# EAGLE design Arduino_S3v3_R2_ftdi (EAGLE 6.2)
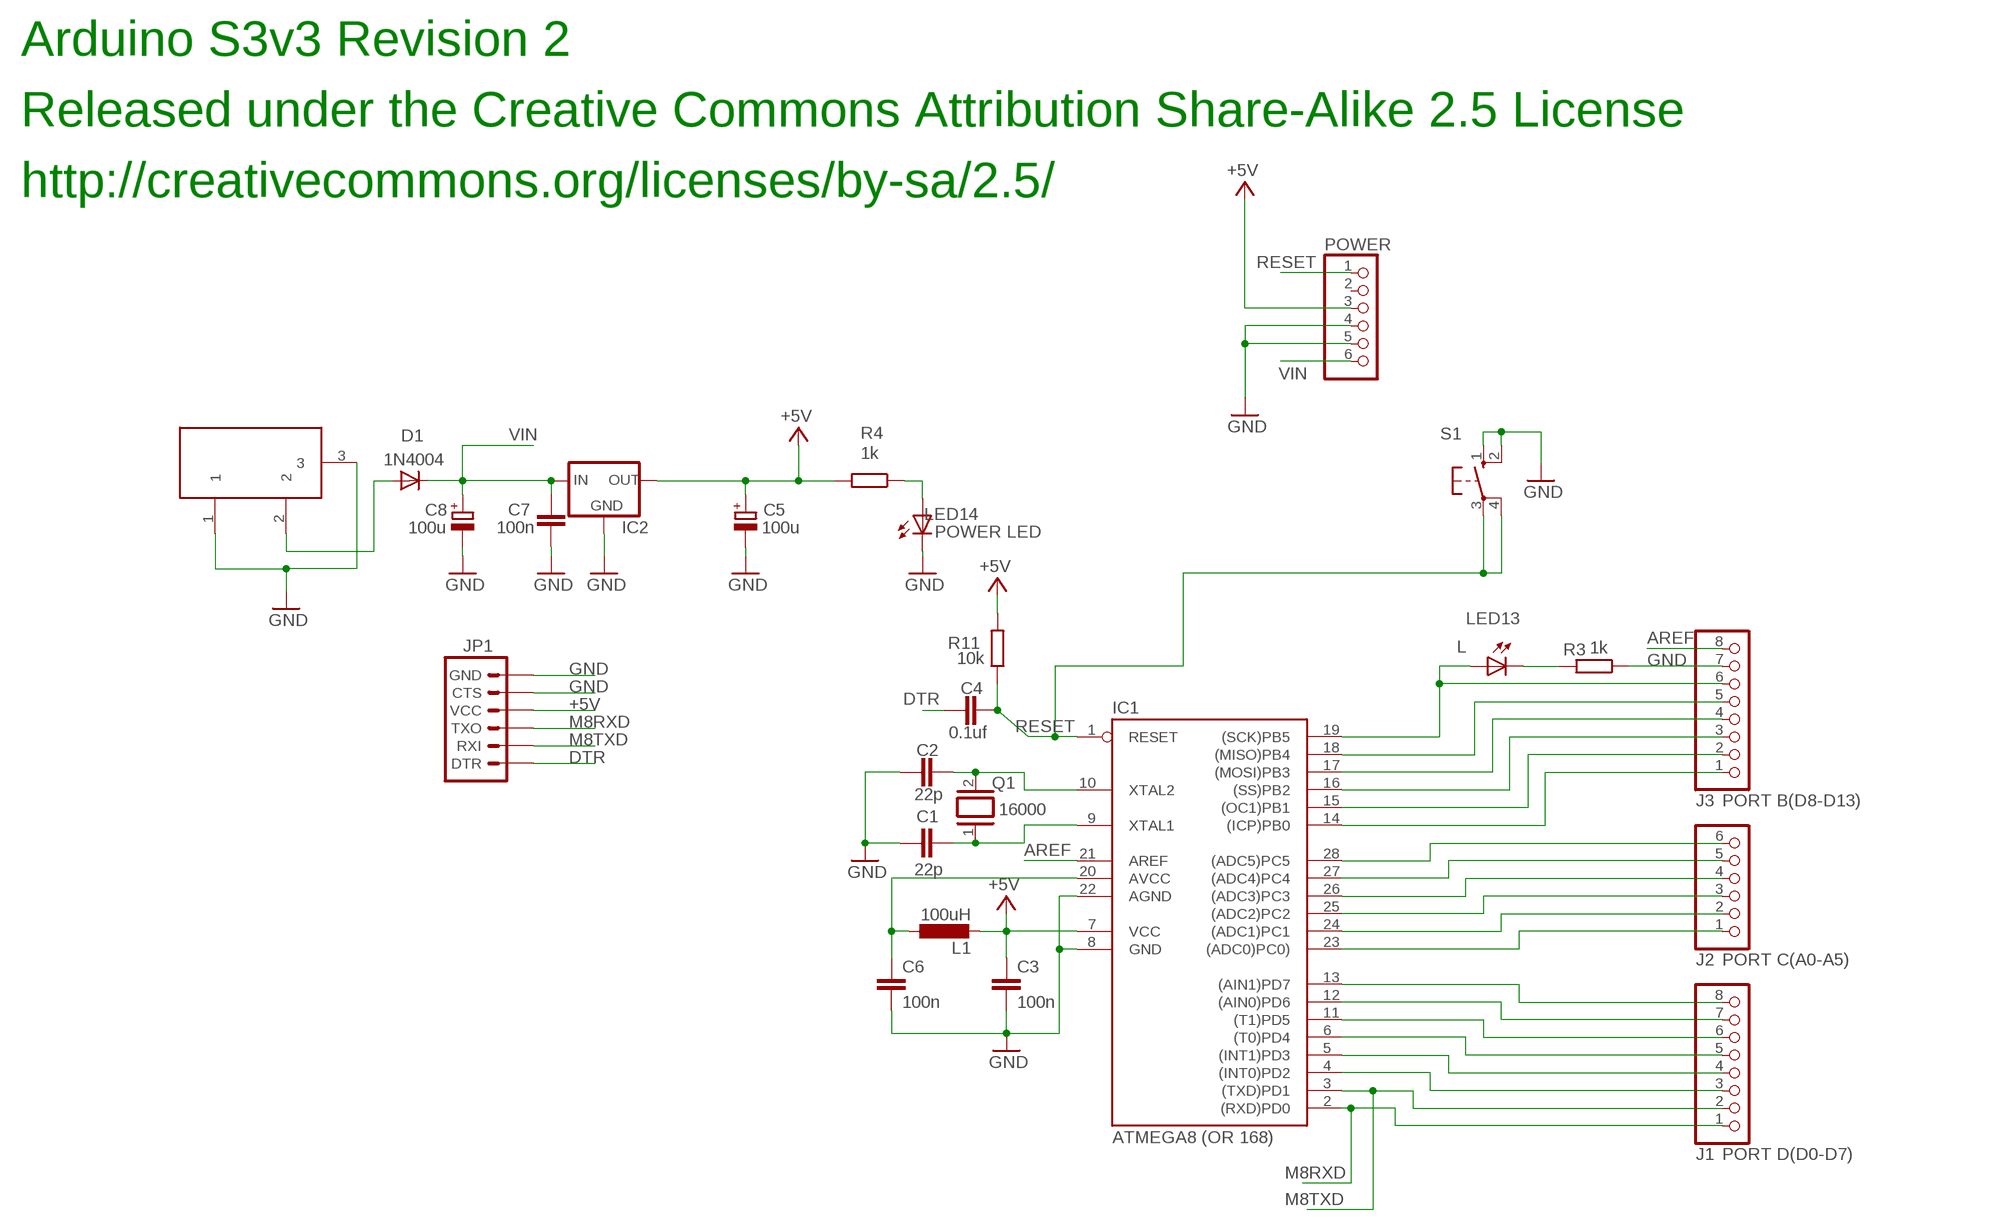
[diagram p0: schematic, sheet 1]

## Parts
C1  22p  C-EU050-025X075  [C050-025X075]
C2  22p  C-EU050-025X075  [C050-025X075]
C3  100n  C-EU050-025X075  [C050-025X075]
C4  0.1uf  C-EU050-025X075  [C050-025X075]
C5  100u  CPOL-EUE3.5-8  [E3,5-8]
C6  100n  C-EU050-025X075  [C050-025X075]
C7  100n  C-EU050-025X075  [C050-025X075]
C8  100u  CPOL-EUE3.5-8  [E3,5-8]
D1  1N4004  [DO41-10]
DC1  DC21MMX  [DC-21MM]
IC1  ATMEGA8 (OR 168)  AT90S4433P  [DIL28-3]
IC2  78XXL  [78XXL]
J1  PORT D(D0-D7)  PINHD-1X8  [1X08]
J2  PORT C(A0-A5)  PINHD-1X6  [1X06]
J3  PORT B(D8-D13)  PINHD-1X8  [1X08]
JP1  ARDUINO_SERIAL_PROGRAMLONGPADS  [1X06_LONGPADS]
L1  100uH  L-EU0207/10  [0207/10@1]
LED13  L  LED3MM  [LED3MM]
LED14  POWER LED  LED3MM  [LED3MM]
POWER  PINHD-1X6  [1X06]
Q1  16000  XTAL  [Q]
R3  1k  R-EU_0207/10  [0207/10]
R4  1k  R-EU_0207/10  [0207/10]
R11  10k  R-EU_0207/10  [0207/10]
S1  10-XX  [B3F-10XX]

## Nets
+5V [power]: C3.1 C5.+ IC1.7(VCC) IC2.OUT JP1.4(VCC) L1.2 POWER.3 R4.2 R11.2
AREF: IC1.21(AREF) J3.8
DTR: C4.1 JP1.1(DTR)
GND: C1.1 C2.1 C3.2 C5.- C6.2 C7.1 C8.- DC1.1 DC1.3 IC1.8(GND) IC1.22(AGND) IC2.GND J3.7 JP1.5(CTS) JP1.6(GND) LED14.K(C) POWER.4 POWER.5 R3.1 S1.1(S) S1.2(S1)
M8RXD: IC1.2((RXD)PD0) J1.1 JP1.3(TXO)
M8TXD: IC1.3((TXD)PD1) J1.2 JP1.2(RXI)
N$1: IC1.18((MISO)PB4) J3.5
N$3: LED14.A R4.1
N$4: IC1.17((MOSI)PB3) J3.4
N$5: IC1.14((ICP)PB0) J3.1
N$6: C1.2 IC1.9(XTAL1) Q1.1
N$7: C2.2 IC1.10(XTAL2) Q1.2
N$8: D1.A DC1.2
N$10: IC1.4((INT0)PD2) J1.3
N$11: IC1.5((INT1)PD3) J1.4
N$12: IC1.6((T0)PD4) J1.5
N$13: IC1.11((T1)PD5) J1.6
N$14: IC1.12((AIN0)PD6) J1.7
N$15: IC1.13((AIN1)PD7) J1.8
N$16: IC1.23((ADC0)PC0)) J2.1
N$17: IC1.24((ADC1)PC1) J2.2
N$18: IC1.25((ADC2)PC2) J2.3
N$19: IC1.26((ADC3)PC3) J2.4
N$20: IC1.27((ADC4)PC4) J2.5
N$21: IC1.28((ADC5)PC5) J2.6
N$22: IC1.15((OC1)PB1) J3.2
N$23: IC1.16((SS)PB2) J3.3
N$31: LED13.K(C) R3.2
N$42 [power]: C6.1 IC1.20(AVCC) L1.1
RESET: C4.2 IC1.1(RESET) POWER.1 R11.1 S1.3(P) S1.4(P1)
SCK: IC1.19((SCK)PB5) J3.6 LED13.A
VIN [power]: C7.2 C8.+ D1.C IC2.IN POWER.6
Unconnected: POWER.2

## Notes on the sheet
- Arduino S3v3 Revision 2
- Released under the Creative Commons Attribution Share-Alike 2.5 License
- http://creativecommons.org/licenses/by-sa/2.5/

## Library data of the parts
C1-C4 C6 C7 = rcl:C-EU: CAPACITOR, European symbol
C5 C8 = rcl:CPOL-EU: POLARIZED CAPACITOR, European symbol
D1 = diode:1N4004: DIODE general purpose rectifier, 1 A
DC1 = powersupply:DC21MM
IC1 = atmel:AT90S4433: MICROCONTROLLER 4 Kbytes FLASH 128 bytes SRAM 256 bytes EEPROM UART 6-channel 10 bit ADC
IC2 = v-reg:78XXL: VOLTAGE REGULATOR
J1 J3 = pinhead:PINHD-1X8: PIN HEADER
J2 POWER = pinhead:PINHD-1X6: PIN HEADER
JP1 = SparkFun:ARDUINO_SERIAL_PROGRAM
L1 = rcl:L-EU: INDUCTOR, European symbol
LED13 LED14 = led:LED: LED OSRAM: - CHIPLED LG R971, LG N971, LY N971, LG Q971, LY Q971, LO R971, LY R971 LH N974, LH R974 LS Q976, LO Q976, LY Q976 LO Q996 - Hyper CHIPLED LW Q18S LB Q993, LB Q99A, LB R99A - SideLED LS A670, LO A670, LY A670, LG A670, LP A670 LB A673, LV A673, LT A673, LW A673 LH A674 LY A675 LS A676, LA A676, LO A676, LY A676, LW A676 LS A679, LY A679, LG A679 - Hyper Micro SIDELED® LS Y876, LA Y876, LO Y876, LY Y876 LT Y87S - SmartLED LW L88C, LW L88S LB L89C, LB L89S, LG L890 LS L89K, LO L89K, LY L89K LS L896, LA L896, LO L896, LY L896 - TOPLED LS T670, LO T670, LY T670, LG T670, LP T670 LSG T670, LSP T670, LSY T670, LOP T670, LYG T670 LG T671, LOG T671, LSG T671 LB T673, LV T673, LT T673, LW T673 LH T674 LS T676, LA T676, LO T676, LY T676, LB T676, LH T676, LSB T676, LW T676 LB T67C, LV T67C, LT T67C, LS T67K, LO T67K, LY T67K, LW E67C LS E67B, LA E67B, LO E67B, LY E67B, LB E67C, LV E67C, LT E67C LW T67C LS T679, LY T679, LG T679 LS T770, LO T770, LY T770, LG T770, LP T770 LB T773, LV T773, LT T773, LW T773 LH T774 LS E675, LA E675, LY E675, LS T675 LS T776, LA T776, LO T776, LY T776, LB T776 LHGB T686 LT T68C, LB T68C - Hyper Mini TOPLED® LB M676 - Mini TOPLED Santana® LG M470 LS M47K, LO M47K, LY M47K Source: http://www.osram.convergy.de/
Q1 = special:XTAL: CRYSTAL
R3 R4 R11 = rcl:R-EU_: RESISTOR, European symbol
S1 = switch-omron:10-XX: OMRON SWITCH

## Net classes
1 power: width 0.61 mm

## Board
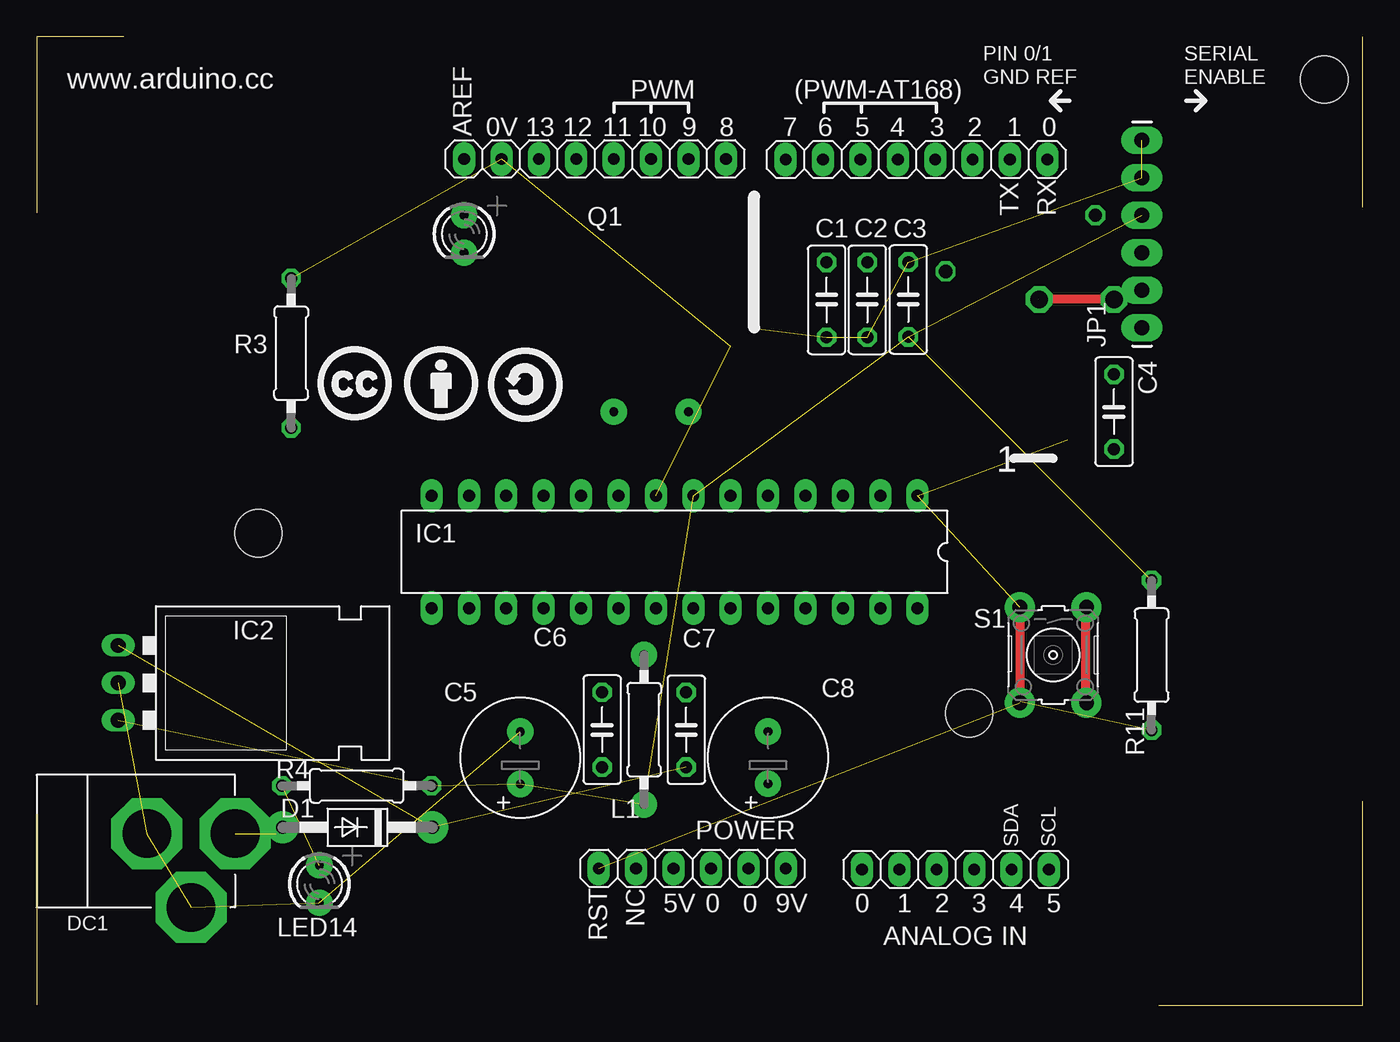
[diagram p1: board, top side]
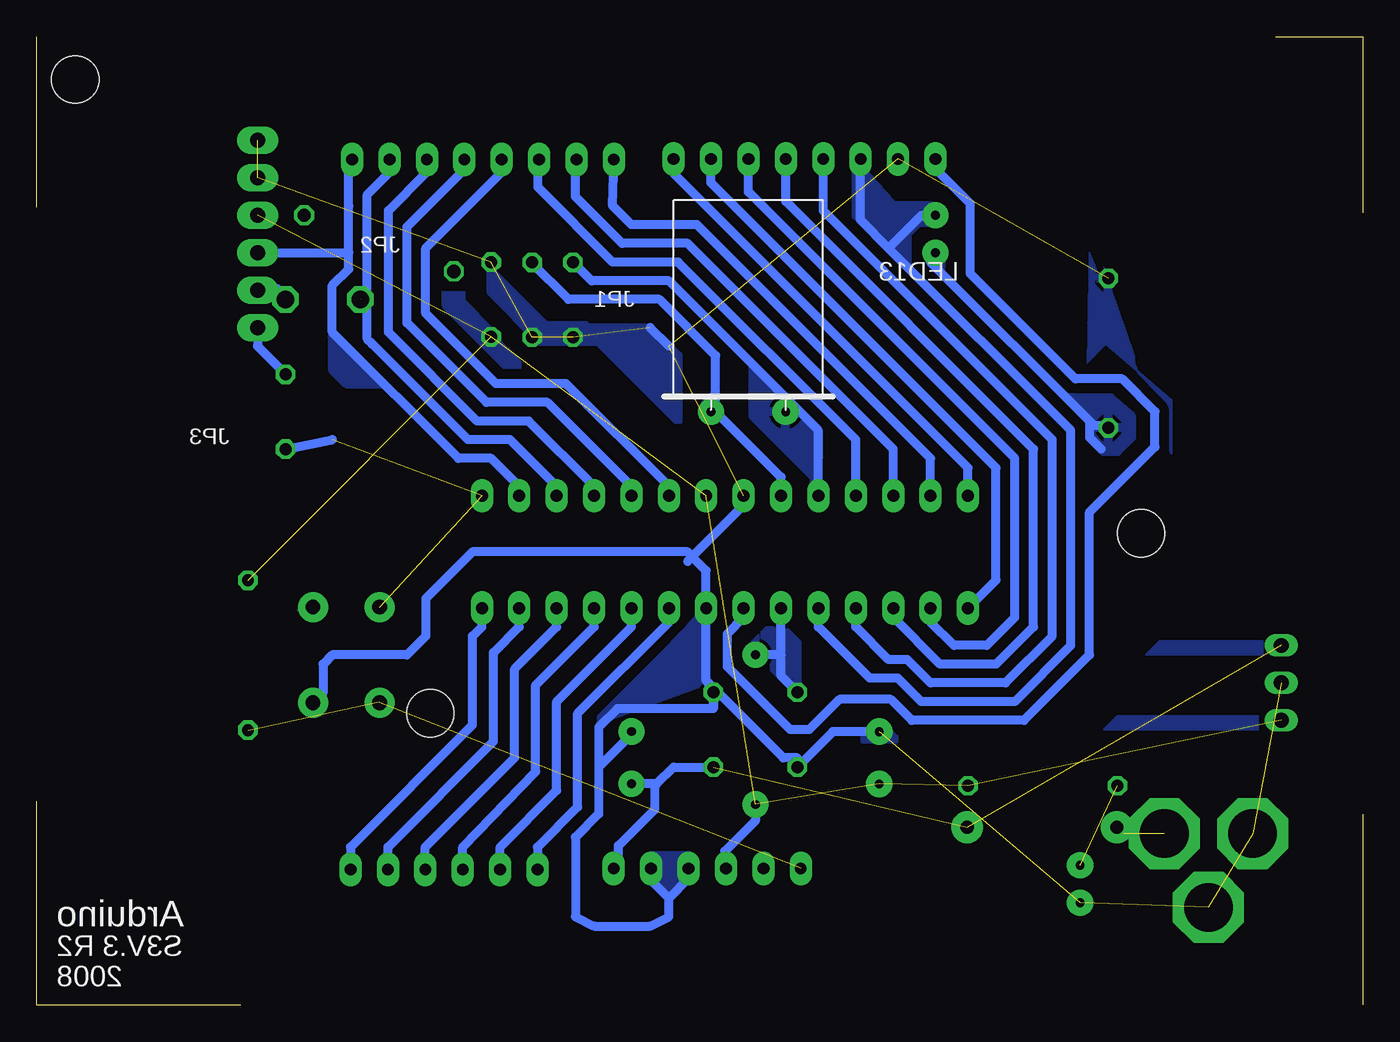
[diagram p2: board, bottom side, seen from below]

Size 90.06 x 65.74 mm. Coordinates in mm from the lower left corner, seen from the top.
Outline: 0.01,65.74 0.01,53.8
Outline: 0.01,12.95 0.01,0
Outline: 76.2,0 90.06,0
Outline: 5.91,65.74 0,65.74
Outline: 90.06,0.01 90.06,13.85
Outline: 90.05,54.18 90.05,65.73
Copper layers (1*16): Top 0.035mm / dielectric 1.5mm / Bottom 0.035mm
Design rules: minimum track width 0.6mm, minimum drill 0.6mm, track to track 0.67mm, track to pad 0.67mm, pad to pad 0.67mm, via to via 0.67mm, smd to smd 0mil, copper to edge 0mil, drill to drill 8mil, minimum pad ring 10mil, minimum via ring 8mil, stop-mask expansion 0mil, vias tented up to drill 0mil, thermal gap 10mil
Holes 3.2 mm at 87.45,62.83 63.32,19.81 15.06,32.03
bRestrict: 6 lines

### Footprints (pad centres in the part's own frame; a part is rotated, then mirrored left to right if it is on the bottom)
C050-025X075 = drill 0.813 octagon: 1 -2.54,0; 2 2.54,0
E3,5-8 = drill 0.6 pad 1.778: + -1.778,0; - 1.778,0
DO41-10 = drill 0.9 pad 2.159: A 5.08,0; C -5.08,0
DC-21MM = drill 3.302 pad 4.826 octagon: 1 -5.08,-3.353; 2 -0.076,-6.35; 3 -0.076,-0.356
DIL28-3 = drill 0.813 pad 1.524 long: 1 -16.51,-3.81; 2 -13.97,-3.81; 3 -11.43,-3.81; 4 -8.89,-3.81; 5 -6.35,-3.81; 6 -3.81,-3.81; 7 -1.27,-3.81; 8 1.27,-3.81; 9 3.81,-3.81; 10 6.35,-3.81; 11 8.89,-3.81; 12 11.43,-3.81; 13 13.97,-3.81; 14 16.51,-3.81; 15 16.51,3.81; 16 13.97,3.81; 17 11.43,3.81; 18 8.89,3.81; 19 6.35,3.81; 20 3.81,3.81; 21 1.27,3.81; 22 -1.27,3.81; 23 -3.81,3.81; 24 -6.35,3.81; 25 -8.89,3.81; 26 -11.43,3.81; 27 -13.97,3.81; 28 -16.51,3.81
78XXL = drill 1.016 long: GND 0,-3.81; IN -2.54,-3.81; OUT 2.54,-3.81
1X08 = drill 0.8 pad 1.524 long: 1 -8.89,0; 2 -6.35,0; 3 -3.81,0; 4 -1.27,0; 5 1.27,0; 6 3.81,0; 7 6.35,0; 8 8.89,0
1X06 = drill 0.8 pad 1.524 long: 1 -6.35,0; 2 -3.81,0; 3 -1.27,0; 4 1.27,0; 5 3.81,0; 6 6.35,0
1X06_LONGPADS = drill 1.016 pad 1.88 long: 1 0,0; 2 2.54,0; 3 5.08,0; 4 7.62,0; 5 10.16,0; 6 12.7,0
0207/10@1 = drill 0.6 pad 1.778: 1 -5.08,0; 2 5.08,0
LED3MM = drill 0.6 pad 1.778: A -1.27,0; K 1.27,0
Q = drill 0.6 pad 1.778: 1 -2.54,-7.62; 2 2.54,-7.62
0207/10 = drill 0.813 octagon: 1 -5.08,0; 2 5.08,0
B3F-10XX = drill 1 pad 2.032: 1 -3.251,2.261; 2 3.251,2.261; 3 -3.251,-2.261; 4 3.251,-2.261

### Placement (x,y rotation side)
C1  56.41,47.88 90 top
C2  53.65,47.88 90 top
C3  59.2,47.9 90 top
C4  73.16,40.29 270 top
C5  32.84,16.79 90 top
C6  38.4,18.7 270 top
C7  44.11,18.69 270 top
C8  49.67,16.79 90 top
D1  21.79,12.07 180 top
DC1  7.12,11.71 90 top
IC1  43.32,30.76 180 top
IC2  9.35,21.87 270 top
J1  59.75,57.41 180 top
J2  62.4,9.2 0 top
J3  37.91,57.45 180 top
JP1  75.07,46 90 top
L1  41.25,18.7 270 top
LED13  29.03,52.35 270 top
LED14  19.19,8.22 270 top
POWER  44.52,9.28 0 top
Q1  41.73,47.91 0 bottom
R3  17.28,44.26 270 top
R4  21.73,14.89 0 top
R11  75.72,23.75 90 top
S1  69.04,23.77 270 top
U$1  [CC]  19.03,39.65 0 top
U$2  [BY]  24.9,39.65 0 top
U$3  [SA]  30.62,39.65 0 top

### Tracks (layer width: path | path; a pad name or v marks a point on that pad's centre or on a via)
+5V  (7 unrouted)
  Bottom 0.61: L1.2 41.25,12.51 43.32,10.44 43.32,9.35 POWER.3
  pour Bottom (no thermals): 7.12,18.7 17.6,18.7 16.65,19.65 7.12,19.65
  pour Bottom (no thermals): 59.19,45.37 57.29,43.46 58.24,43.46 62.21,47.43 62.21,50.13 61.26,50.13 61.26,47.75 59.19,45.69
AREF
  Bottom 0.6: IC1.21 42.05,26.64 42.05,26.32 43.16,25.21 43.16,22.98 41.25,21.08 38.87,18.7 37.6,18.7 35.54,20.76 32.05,20.76 30.62,19.33 23,19.33 18.55,23.78 18.55,33.46 14.11,37.91 14.11,40.29 16.33,42.51 19.5,42.51 26.65,49.65 26.65,54.42 28.71,56.48 28.71,57.43 J3.8
DTR
  Bottom 0.61: JP1.1 75.07,44.73 C4.1
GND  (12 unrouted)
  Top 0.6: 71.26,20.6 S1.2 | 71.26,20.6 71.26,26.95 S1.1 | S1.2 71.26,20.6
  Bottom 0.6: 44.11,20.13 50.62,20.13 51.89,18.86 51.89,16.16 | 51.89,16.16 51.89,12.98 53.48,11.4 53.48,6 52.21,5.36 48.4,5.36 47.13,6 47.13,7.27 | 71.3,26.95 71.26,26.95 71.52,27.22 | 47.13,7.27 48.4,8.54 48.4,9.17 48.33,9.17 POWER.5 | POWER.4 45.79,8.61 47.13,7.27 | 47.13,44.73 48.4,46 | C6.2 38.4,16.79 39.34,16.79 43.95,21.4 | 43.95,21.4 44.43,21.87 44.46,21.87 44.11,20.6 44.11,20.13 | C7.1 44.11,20.92 44.11,20.13 | C8.- 49.67,18.38 51.89,16.16 | 43.95,21.4 | IC1.22 44.59,22.03 43.95,21.4
  Bottom 0.61: C5.- 35.99,18.57 C6.2 | IC1.22 44.59,29.49 45.54,30.44 | 45.54,30.44 45.86,30.76 60.46,30.76 63.64,27.59 63.64,25.05 64.91,23.78 69.99,23.78 70.62,23.14 70.62,21.2 S1.2 | IC1.8 42.05,33.94 45.54,30.44 | 45.86,30.13 45.54,30.44
  Bottom 1.016: S1.1 71.3,26.95
  pour Bottom: 18.55,51.08 18.71,43.62 17.44,44.89 13,41.08 13,37.43
  pour Bottom: 46.49,44.1 46.49,39.65 52.84,46 48.4,46
  pour Bottom (no thermals): 45.7,10.12 48.4,10.12 48.4,8.86 47.13,7.58 45.7,9.01
  pour Bottom (no thermals): 70.62,26.79 70.78,26.64 72.21,26.64 72.37,26.79
  pour Bottom: 15.7,43.78 16.65,44.73 18.24,51.08
  pour Bottom (no thermals): 59.19,49.81 55.54,46.16 52.84,46.16 51.73,45.05 55.86,45.05 59.19,48.38
  pour Bottom: 51.89,19.33 46.97,24.25 44.59,24.25 44.59,22.03
  pour Bottom (no thermals): 46.97,24.25 44.59,26.79 44.59,24.25
  pour Bottom (no thermals): 32.84,19.17 31.73,18.06 33.95,18.06
M8RXD
  Bottom 0.6: IC1.2 57.29,35.21 59.19,37.11 61.41,37.11 69.99,45.69 69.99,48.86 68.88,49.97 68.88,51.08 | 68.88,54.26 68.88,56.96 68.64,57.36 J1.1
  Bottom 0.61: JP1.3 68.88,51.08 68.88,54.26
  pour Bottom: 69.99,45.69 69.99,43.15 69.04,42.19 66.5,42.19
M8TXD  (via drill 1.2)  (1 unrouted)
  Top 0.61: v73.16,47.91 68.04,47.91
  Bottom 0.6: IC1.3 54.75,35.21 57.92,38.38 60.78,38.38 67.29,44.89 67.61,45.21 67.61,47.91 | J1.2 66.1,56.55 66.18,56.48 67.61,55.03 67.61,47.91 | 67.61,47.91 68.04,47.91
  Bottom 0.813: JP1.2 73.8,48.54 v73.16,47.91
N$1
  Bottom 0.6: J3.5 36.64,53.93 21.09,38.38 21.09,25.05 24.27,21.87 29.35,21.87 30.93,23.46 32.21,23.46 34.43,25.68 IC1.18
N$2  (via drill 1.2)
  other vias: 68.08,47.91
N$3  (1 unrouted)
N$4
  Bottom 0.6: J3.4 39.18,54.57 22.36,37.75 22.36,25.68 24.9,23.14 28.71,23.14 31.89,26.32 IC1.17
N$5
  Bottom 0.6: IC1.14 26.81,36.48 46.81,56.48 46.81,57.12 J3.1
N$6
  Bottom 0.6: IC1.9 39.51,35.84 43.95,40.29 | 43.95,40.29 Q1.1 | 43.95,40.29 43.95,44.1 47.76,47.91 53.95,47.91 56.49,50.45 C1.2
  pour Bottom (no thermals): 44.27,39.65 43,39.65 43.95,40.6 43.95,41.88 44.91,40.92 44.91,40.29
N$7
  Bottom 0.6: 38.87,40.92 39.83,41.88 | 38.87,40.92 47.13,49.18 52.37,49.18 53.64,50.45 53.65,50.45 C2.2 | IC1.10 36.97,39.02 38.87,40.92 | 38.87,40.92 Q1.2
  pour Bottom: 36.97,37.11 38.56,37.11 41.41,39.97 41.41,43.46 36.97,39.02
  pour Bottom (no thermals): 38.56,37.11 37.29,35.84 37.29,35.05 36.97,35.05 36.97,37.11
N$8  (1 unrouted)
  Bottom 0.6: 16.65,12.03 16.65,12.07
  Bottom 1.016: 16.65,12.07 D1.A | 16.25,11.64 16.65,12.03
N$9  (via drill 0.9)
  other vias: 61.73,49.81
N$10
  Bottom 0.6: IC1.4 52.21,35.21 56.65,39.65 60.15,39.65 66.18,45.68 66.18,53.94 63.64,56.48 63.64,57.43 J1.3
N$11
  Bottom 0.6: IC1.5 49.67,35.21 55.38,40.92 59.51,40.92 64.91,46.32 64.91,52.83 61.1,56.64 61.1,57.43 J1.4
N$12
  Bottom 0.6: IC1.6 47.13,35.21 54.11,42.19 58.87,42.19 63.64,46.95 63.64,51.4 58.56,56.48 58.56,57.43 J1.5
N$13
  Bottom 0.6: IC1.11 34.43,38.38 46.49,50.45 50.94,50.45 56.02,55.53 56.02,57.41 | 56.02,57.41 56.02,57.43 | 56.02,57.41 J1.6
N$14
  Bottom 0.6: IC1.12 31.89,37.75 45.86,51.72 50.3,51.72 53.48,54.89 53.48,57.41 | 53.48,57.41 53.48,57.43 | 53.48,57.41 J1.7
N$15
  Bottom 0.6: IC1.13 29.35,37.11 45.22,52.99 49.67,52.99 50.94,54.26 J1.8
N$16
  Bottom 0.6: IC1.23 47.13,26 53.32,19.81 53.32,13.46 56.05,10.73 J2.1
N$17
  Bottom 0.6: IC1.24 49.67,25.68 54.75,20.6 54.75,14.57 58.59,10.73 J2.2
N$18
  Bottom 0.6: IC1.25 52.21,25.68 56.18,21.71 56.18,15.84 61.13,10.73 J2.3
N$19
  Bottom 0.6: IC1.26 54.75,25.68 57.61,22.82 57.61,16.79 63.67,10.73 J2.4
N$20
  Bottom 0.6: IC1.27 57.29,25.68 59.03,23.94 59.03,17.9 66.21,10.73 J2.5
N$21
  Bottom 0.6: IC1.28 59.83,25.68 60.46,25.05 60.46,19.02 68.75,10.73 J2.6
N$22
  Bottom 0.6: IC1.15 24.9,28.86 24.9,36.48 44.27,55.84 44.27,57.12 J3.2
N$23
  Bottom 0.6: IC1.16 29.35,26 27.76,24.41 25.54,24.41 23.63,26.32 23.63,37.11 41.73,55.21 41.73,57.12 | 41.73,57.12 41.73,57.43 | 41.73,57.12 J3.3
N$24  (via drill 0.9)
  other vias: 71.89,53.62
N$31
  Bottom 0.6: 18.24,39.34 29.35,50.45 29.35,51.08 LED13.K | R3.2 | R3.2 | R3.2 17.28,39.34 18.24,39.34 | 17.76,37.75 18.55,38.54 18.55,39.49 18.39,39.34 18.24,39.34
  pour Bottom (no thermals): 28.4,51.08 28.4,49.49 29.35,50.45 29.35,51.08
  pour Bottom: 15.7,38.54 15.7,39.97 17.12,41.24 20.14,41.24 18.55,39.65 18.55,38.54 17.6,37.59 16.65,37.59
N$42
  Bottom 0.6: 39.51,23.78 39.51,22.35 C6.1 | 39.51,23.78 IC1.20 | 39.51,23.78 | 39.51,23.78 L1.1
  pour Bottom: 38.4,21.24 38.4,24.57 39.51,25.68 39.51,26.32 41.41,24.41 41.41,24.25
RESET  (4 unrouted)
  Top 0.6: S1.3 66.81,26.95 66.81,20.6 S1.4
  Bottom 0.61: C4.2 69.99,38.38
SCK
  Bottom 0.6: IC1.19 36.97,25.68 33.48,22.19 31.57,22.19 29.98,20.6 23.63,20.6 19.82,24.41 19.82,39.02 32.21,51.4 | 32.21,51.4 34.11,53.3 34.11,57.43 J3.6 | LED13.A 29.98,53.62 32.21,51.4
  pour Bottom (no thermals): 30.94,50.13 30.94,52.35 30.14,53.15 29.03,53.15 29.03,53.94 29.35,54.26 31.89,54.26 34.43,57.12 34.43,53.62
VIN  (2 unrouted)
  Bottom 0.6: 48.08,15.01 47.95,15.01 46.81,16.16 C7.2 | 48.08,15.01 C8.+ | POWER.6 50.87,9.56 50.54,9.89 50.55,10.83 48.08,13.3 48.08,15.01 | 48.08,15.01 48.08,15.05
  pour Bottom (no thermals): 6.81,23.78 14.74,23.78 13.79,24.73 6.81,24.73

### Text on the board
tNames: PIN 0/1 | SERIAL | www.arduino.cc | GND REF | ENABLE | PWM | (PWM-AT168) | AREF | 0V | 13 | 12 | 11 | 10 | 9 | 8 | 7 | 6 | 5 | 4 | 3 | 2 | 1 | 0 | TX | RX | 1 | SDA | SCL | 5V | 0 | 0 | 9V | 0 | 1 | 2 | 3 | 4 | 5 | NC | RST | ANALOG IN
bNames: JP2 | LED13 | JP1 | JP3 | Arduino | S3V.3 R2 | 2008
bValues: ENABLE
bRestrict: Arduino | R.2 | V.3 | S3 | Pin0/1 | 2008 | REF | GND | SERIAL | ON | www.arduino.cc | AKASHI | A. | BANZI | M. | AUTO | CUARTIELLES | D. | CC BY SA 2.5 | RESET | ENABLE | MARTINO | G. | IGOE | T. | ZAMBETTI | N. | MELLIS | D.
tCredits: ADILSON AKASHI | MASSIMO BANZI | DAVID CUARTIELLES | TOM IGOE | GIANLUCA MARTINO | DAVID A. MELLIS | NICHOLAS ZAMBETTI | Released under the Creative Commons Attribution Share-Alike 2.5 License | http://creativecommons.org/licenses/by-sa/2.5/
Cooper Text: A | 0 | 13 | 12 | 11 | 10 | 9 | 8 | 7 | 6 | 5 | 4 | 3 | 2 | 1 | 0 | 1 | R | 5 | 0 | 0 | 9 | 0 | 1 | 2 | 3 | 4 | 5 | Analog in
bCredits: ADILSON AKASHI | MASSIMO BANZI | DAVID CUARTIELLES | TOM IGOE | GIANLUCA MARTINO | DAVID A. MELLIS | NICHOLAS ZAMBETTI | Released under the Creative Commons Attribution Share-Alike 2.5 License | http://creativecommons.org/licenses/by-sa/2.5/